# Altium schematic sheet MiniPC MB GOST.SchDoc
size 594 x 420 mm; AdditionFace: Рук.проекта; AdditionFaceBy: Сидоров; StandartControlBy: Смирнов; Letter1: {Э}; DocumentType: Схема электрическая принципиальная; Title1: {Наименование}; Title2: {Наименование}; GroupNumber: {ХХХХ.000000.001-01}; PageSetup: Record=PageOptions|CenterHorizontal=True|CenterVertical=True|PrintScale=1.00|XCorrection=1.00|YCorrection=1.00|PrintKind=2|BorderSize=5000000|LeftOffset=0|BottomOffset=0|Orientation=2|PaperLength=1000|PaperWidth=1000|Scale=100|PaperSource=7|PrintQuality=-3|MediaType=1|DitherType=10|PrintScaleMode=1|PaperKind=A4|PaperIndex=9; Author: ALTIUM GOSTBOM2.0 KEV; SheetNumber: 1; SheetTotal: 48
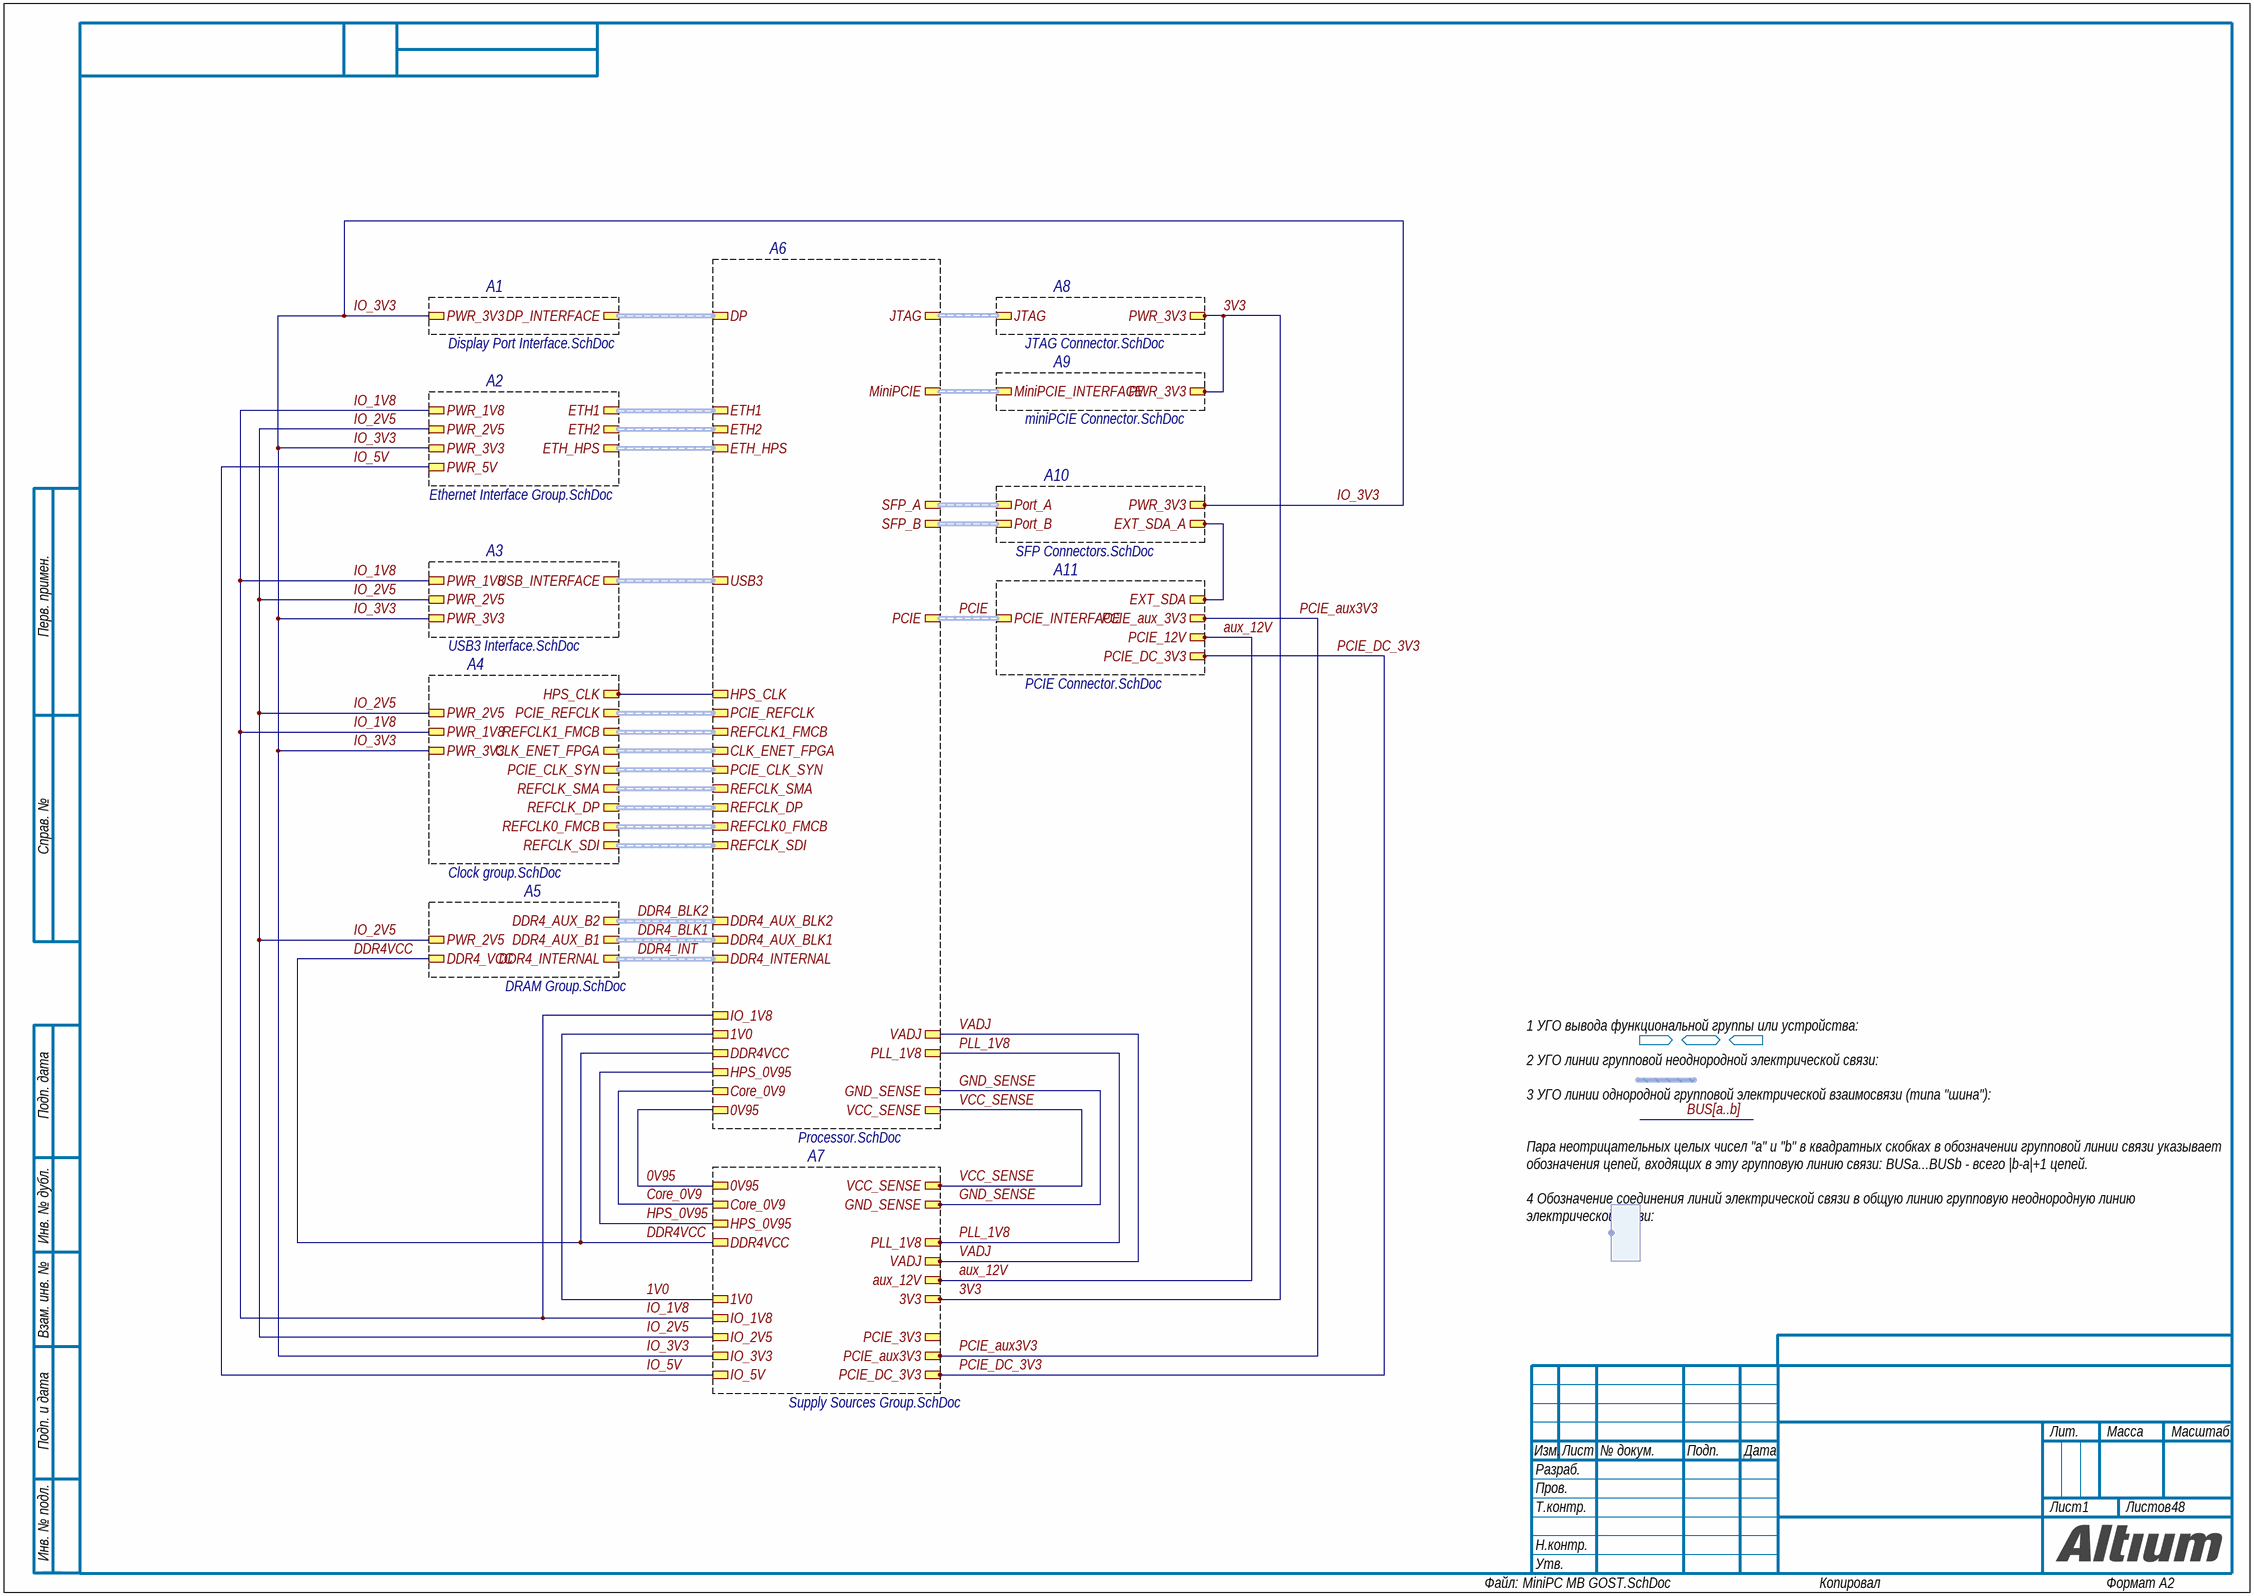
[diagram p0: MiniPC MB GOST.SchDoc]

## Sub-sheets
A1 = Display Port Interface.SchDoc: DP_INTERFACE (harness DP_INTERFACE), PWR_3V3
A2 = Ethernet Interface Group.SchDoc: PWR_1V8, ETH1 (harness ETHERNET), ETH2 (harness ETHERNET), PWR_2V5, PWR_5V, PWR_3V3, ETH_HPS (harness ETHERNET_HPS)
A3 = USB3 Interface.SchDoc: PWR_1V8, USB_INTERFACE (harness USB3), PWR_3V3, PWR_2V5
A4 = Clock group.SchDoc: REFCLK1_FMCB (harness DIFFPAIR), PCIE_REFCLK (harness DIFFPAIR), HPS_CLK, PWR_3V3, CLK_ENET_FPGA (harness DIFFPAIR), PCIE_CLK_SYN (harness DIFFPAIR), REFCLK_SMA (harness DIFFPAIR), REFCLK_DP (harness DIFFPAIR), REFCLK0_FMCB (harness DIFFPAIR), PWR_1V8, REFCLK_SDI (harness DIFFPAIR), PWR_2V5
A5 = DRAM Group.SchDoc: DDR4_INTERNAL (harness DDR4_2C), DDR4_VCC, PWR_2V5, DDR4_AUX_B1 (harness DDR4_SODIMM), DDR4_AUX_B2 (harness DDR4_SODIMM)
A6 = Processor.SchDoc: 0V95, Core_0V9, HPS_0V95, DDR4VCC, 1V0, IO_1V8, VCC_SENSE, GND_SENSE, PLL_1V8, VADJ, DP (harness DP_INTERFACE), ETH1 (harness ETHERNET), ETH2 (harness ETHERNET), ETH_HPS (harness ETHERNET_HPS), PCIE_REFCLK (harness DIFFPAIR), REFCLK1_FMCB (harness DIFFPAIR), CLK_ENET_FPGA (harness DIFFPAIR), PCIE_CLK_SYN (harness DIFFPAIR), REFCLK_SMA (harness DIFFPAIR), REFCLK_DP (harness DIFFPAIR), REFCLK0_FMCB (harness DIFFPAIR), REFCLK_SDI (harness DIFFPAIR), DDR4_AUX_BLK2 (harness DDR4_SODIMM), DDR4_AUX_BLK1 (harness DDR4_SODIMM), DDR4_INTERNAL (harness DDR4_2C), PCIE (harness PCIE), SFP_B (harness SFP), SFP_A (harness SFP), MiniPCIE (harness MiniPCIE), JTAG (harness JTAG), HPS_CLK, USB3 (harness USB3)
A7 = Supply Sources Group.SchDoc: 0V95, PCIE_3V3, VCC_SENSE, GND_SENSE, aux_12V, 1V0, IO_1V8, PLL_1V8, VADJ, PCIE_aux3V3, PCIE_DC_3V3, Core_0V9, IO_2V5, IO_5V, HPS_0V95, DDR4VCC, IO_3V3, 3V3
A8 = JTAG Connector.SchDoc: JTAG (harness JTAG), PWR_3V3
A9 = miniPCIE Connector.SchDoc: PWR_3V3, MiniPCIE_INTERFACE (harness MiniPCIE)
A10 = SFP Connectors.SchDoc: Port_A (harness SFP), EXT_SDA_A, Port_B (harness SFP), PWR_3V3
A11 = PCIE Connector.SchDoc: PCIE_12V, PCIE_DC_3V3, EXT_SDA, PCIE_INTERFACE (harness PCIE), PCIE_aux_3V3

## Harnesses
111: 

## Nets
0V95: sheet A6/0V95, sheet A7/0V95
1V0: sheet A6/1V0, sheet A7/1V0
3V3: sheet A7/3V3, sheet A8/PWR_3V3, sheet A9/PWR_3V3
aux_12V: sheet A7/aux_12V, sheet A11/PCIE_12V
Core_0V9: sheet A6/Core_0V9, sheet A7/Core_0V9
DDR4VCC: sheet A6/DDR4VCC, sheet A5/DDR4_VCC, sheet A7/DDR4VCC
GND_SENSE: sheet A6/GND_SENSE, sheet A7/GND_SENSE
HPS_0V95: sheet A6/HPS_0V95, sheet A7/HPS_0V95
IO_1V8: sheet A6/IO_1V8, sheet A7/IO_1V8, sheet A2/PWR_1V8, sheet A4/PWR_1V8, sheet A3/PWR_1V8
IO_2V5: sheet A5/PWR_2V5, sheet A7/IO_2V5, sheet A2/PWR_2V5, sheet A4/PWR_2V5, sheet A3/PWR_2V5
IO_3V3: sheet A7/IO_3V3, sheet A2/PWR_3V3, sheet A4/PWR_3V3, sheet A1/PWR_3V3, sheet A10/PWR_3V3, sheet A3/PWR_3V3
IO_5V: sheet A7/IO_5V, sheet A2/PWR_5V
PCIE_aux3V3: sheet A7/PCIE_aux3V3, sheet A11/PCIE_aux_3V3
PCIE_DC_3V3: sheet A7/PCIE_DC_3V3, sheet A11/PCIE_DC_3V3
PLL_1V8: sheet A6/PLL_1V8, sheet A7/PLL_1V8
VADJ: sheet A6/VADJ, sheet A7/VADJ
VCC_SENSE: sheet A6/VCC_SENSE, sheet A7/VCC_SENSE
(unnamed): sheet A6/HPS_CLK, sheet A4/HPS_CLK
(unnamed): sheet A11/EXT_SDA, sheet A10/EXT_SDA_A

## Buses and harness runs
bus BUS[a..b]
harness DDR4_BLK1 = sheet A5/DDR4_AUX_B1 = sheet A6/DDR4_AUX_BLK1
harness DDR4_BLK2 = sheet A5/DDR4_AUX_B2 = sheet A6/DDR4_AUX_BLK2
harness DDR4_INT = sheet A5/DDR4_INTERNAL = sheet A6/DDR4_INTERNAL
harness PCIE = sheet A6/PCIE = sheet A11/PCIE_INTERFACE
harness sheet A1/DP_INTERFACE = sheet A6/DP
harness sheet A2/ETH1 = sheet A6/ETH1
harness sheet A2/ETH2 = sheet A6/ETH2
harness sheet A2/ETH_HPS = sheet A6/ETH_HPS
harness sheet A3/USB_INTERFACE = sheet A6/USB3
harness sheet A4/CLK_ENET_FPGA = sheet A6/CLK_ENET_FPGA
harness sheet A4/PCIE_CLK_SYN = sheet A6/PCIE_CLK_SYN
harness sheet A4/PCIE_REFCLK = sheet A6/PCIE_REFCLK
harness sheet A4/REFCLK0_FMCB = sheet A6/REFCLK0_FMCB
harness sheet A4/REFCLK1_FMCB = sheet A6/REFCLK1_FMCB
harness sheet A4/REFCLK_DP = sheet A6/REFCLK_DP
harness sheet A4/REFCLK_SDI = sheet A6/REFCLK_SDI
harness sheet A4/REFCLK_SMA = sheet A6/REFCLK_SMA
harness sheet A6/JTAG = sheet A8/JTAG
harness sheet A6/MiniPCIE = sheet A9/MiniPCIE_INTERFACE
harness sheet A6/SFP_A = sheet A10/Port_A
harness sheet A6/SFP_B = sheet A10/Port_B

## Notes on the sheet
- 1 УГО вывода функциональной группы или устройства:
  2 УГО линии групповой неоднородной электрической связи:
  3 УГО линии однородной групповой электрической взаимосвязи (типа "шина"):
  Пара неотрицательных целых чисел "a" и "b" в квадратных скобках в обозначении групповой линии связи указывает обозначения цепей, входящих в эту групповую линию связи: BUSa...BUSb - всего |b-a|+1 цепей.
  4 Обозначение соединения линий электрической связи в общую линию групповую неоднородную линию электрической связи:
  5 Основная надпись листов схемы по форме 1 ГОСТ 2.104-2006 (согласно п.5.1 ГОСТ 2.104-2006).
- Перв. примен.
- Справ. №
- Подп. дата
- Инв. № дубл.
- Взам. инв. №
- Подп. и дата
- Изм.
- Разраб.
- Лист
- № докум.
- Подп.
- Дата
- Лит.
- Масса
- Масштаб
- Пров.
- Т.контр.
- Листов
- Инв. № подл.
- Н.контр.
- Утв.
- ALTIUM GOSTBOM2.0 KEV
- Файл:
- Копировал
- Формат А2